# Altium schematic sheet INA226 Current Monitor.SchDoc: INA226 Current Monitor
size Letter; SheetNumber: 23
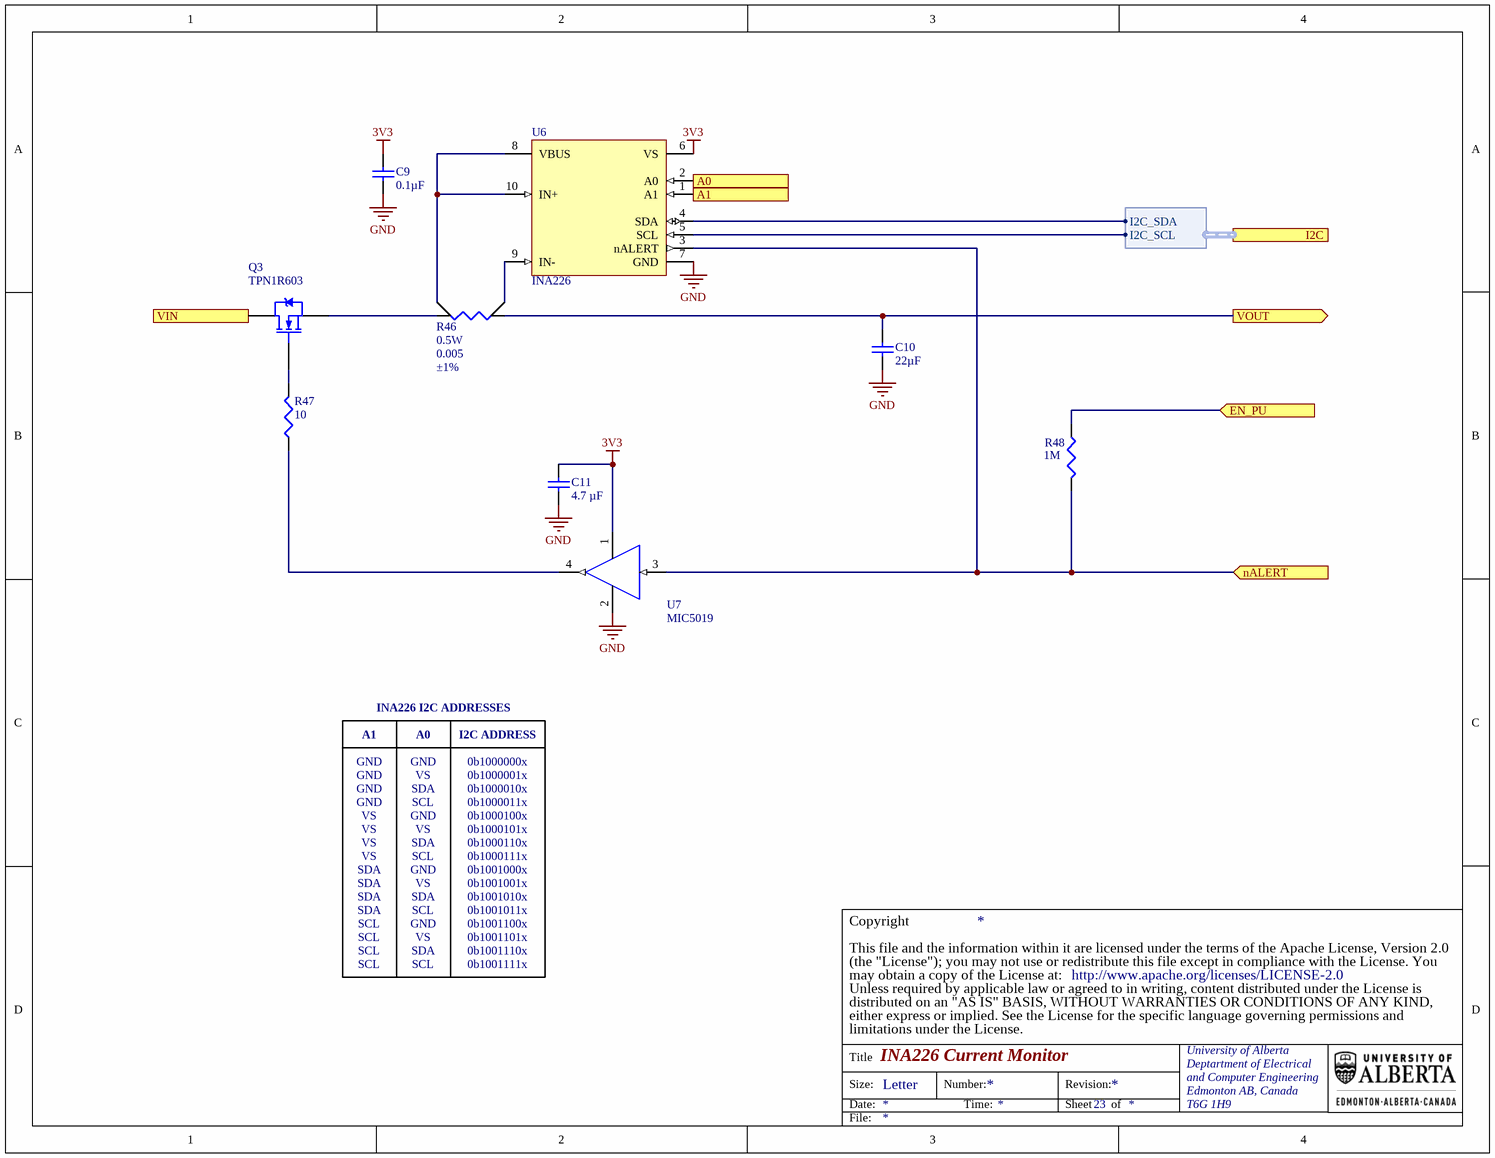
[diagram p0: INA226 Current Monitor.SchDoc]

## Parts
C9  value 0.1µF  [TDK-CGA2B]  (hidden comment: Cap)
C10  value 22µF  [TY-1206L]  (hidden comment: Cap)
C11  value 4.7 µF  [MUR-GRM188]  (hidden comment: Cap)
Q3  TPN1R603  [TOSH-S-3X1S]
R46  value 0.005  Power - Rated: 0.5W  Tolerance: ±1%  [BRN-CRF0805]  (hidden comment: Res Sense)
R47  value 10  [PANA-ERA2A]  (hidden comment: Res3)
R48  value 1M  [PANA-ERJ2R]  (hidden comment: Res3)
U6  INA226  [TI-DGS]
U7  MIC5019  [MCP-MIC5019]

## Ports
A0 (in), A1 (in), EN_PU (in), I2C (harness INA226_I2C), nALERT (in), VIN (in), VOUT (out)

## Harnesses
INA226_I2C: I2C_SCL, I2C_SDA

## Nets
3V3: C9.2 C11.2 U6.6(VS) U7.1(VDD)
GND: C9.1 C10.1 C11.1 U6.7(GND) U7.2(GND)
A0: U6.2(A0) ; port A0
A1: U6.1(A1) ; port A1
EN_PU: R48.2 ; port EN_PU
nALERT: R48.1 U6.3(nALERT) U7.3(IN) ; port nALERT
VIN: Q3.2(D) ; port VIN
VOUT: C10.2 R46.2(I2) ; port VOUT
NetQ3_1: Q3.1(G) R47.2
NetQ3_3: Q3.3(S) R46.1(I1)
NetR46_3: R46.3(S2) U6.9(IN-)
NetR46_4: R46.4(S1) U6.8(VBUS) U6.10(IN+)
NetR47_1: R47.1 U7.4(OUT)
NetU6_4: U6.4(SDA) ; port I2C.I2C_SDA
NetU6_5: U6.5(SCL) ; port I2C.I2C_SCL

## Notes on the sheet
- INA226 I2C ADDRESSES
- A1
- GND
- A0
- VS
- I2C ADDRESS
- 0b1000000x
- 0b1000001x
- SDA
- SCL
- 0b1000010x
- 0b1000011x
- 0b1000100x
- 0b1000101x
- 0b1000110x
- 0b1000111x
- 0b1001000x
- 0b1001001x
- 0b1001010x
- 0b1001011x
- 0b1001100x
- 0b1001101x
- 0b1001110x
- 0b1001111x
- (the "License"); you may not use or redistribute this file except in compliance with the License. You
- This file and the information within it are licensed under the terms of the Apache License, Version 2.0
- Copyright
- Unless required by applicable law or agreed to in writing, content distributed under the License is
- distributed on an "AS IS" BASIS, WITHOUT WARRANTIES OR CONDITIONS OF ANY KIND,
- either express or implied. See the License for the specific language governing permissions and
- limitations under the License.
- may obtain a copy of the License at:
- http://www.apache.org/licenses/LICENSE-2.0
- Title
- Size:
- Date:
- Letter
- Number:
- Time:
- Revision:
- Sheet
- of
- University of Alberta
- Deptartment of Electrical
- and Computer Engineering
- Edmonton AB, Canada
- T6G 1H9
- File:

## Library data of the parts
C9 = PC-TDK-02259: CAP CER 0.1UF 50V X7R 0402; Manufacturer Part Number: CGA2B3X7R1H104K050BB; Index: 2259; Designator: C?; Tolerance: ±10%; Published: 2016-03-16; LatestRevisionDate: 2016-03-16; LatestRevisionNote: ...; PackageReference: 0402 (1005 Metric); Publisher: AlbertaSat; PackageDescription: Radial Cap, Thru-Hole; 2 Leads; 0.3 in Pin Spacing; Part Number: PC-TDK-02259; Supplier Part Number 1: 445-6899-1-ND; Supplier 1: Digi-key; Supplier Link: http://www.digikey.ca/product-search/en?keywords=445-6899-1-ND; Voltage - Rated: 50V; Temperature Coefficient: X7R; Applications: Automotive; Operating Temperature: -55°C ~ 125°C
C10 = PC-TY-00721: CAP CER 22UF 16V X7R 1206; Manufacturer Part Number: EMK316BB7226ML-T; Index: 721; Designator: C?; Tolerance: ±20%; Published: 2016-03-13; LatestRevisionDate: 2016-03-13; LatestRevisionNote: ...; PackageReference: 1206 (3216 Metric); Publisher: AlbertaSat; PackageDescription: Chip Capacitor, 2-Leads, Body 3.20x1.60mm, IPC Low Density; Part Number: PC-TY-00721; Supplier Part Number 1: 587-4319-1-ND; Supplier 1: Digi-key; Supplier Link: http://www.digikey.ca/product-search/en?keywords=587-4319-1-ND; Voltage-Rated: 16V; Temperature Coefficient: X7R; Application: General Purpose; Operating Temperature: -55°C ~ 125°C
C11 = 10165: CAP CER 4.7UF 16V X7R 0603; Part Number: 10165; Manufacturer Part Number: GRM188Z71C475KE21D; Designator: C?; Tolerance: ±10%; Voltage - Rated: 25V; Published: 8-Jun-2000; LatestRevisionDate: 17-Jul-2002; LatestRevisionNote: Re-released for DXP Platform.; PackageReference: 0603 (1608 Metric); Publisher: Altium Limited; PackageDescription: Chip Capacitor, 2-Leads, Body 1.60x0.80mm, IPC Low Density; Supplier Part Number 1: 490-GRM188Z71C475KE21DCT-ND; Supplier 1: Digi-Key; Supplier Link: #https://www.digikey.ca/en/products/detail/murata-electronics/GRM188Z71C475KE21D/13401930#; Temperature Coefficient: X7R; Application: General Purpose; Operating Temperature: -55°C ~ 125°C; Supplier 2: Mouser; Supplier Part Number 2: 81-GRM188Z71C475KE1D
Q3 = PU-TOSH-00002: X35 PB-F POWER MOSFET TRANSISTOR; Index: 2; Designator: Q?; Rds On: 1.6mOhm @ 40A, 10V; Part Number: PU-TOSH-00002; Manufacturer Part Number: TPN1R603PL,L1Q; Supplier Part Number 1: TPN1R603PLL1QCT-ND; Supplier 1: Digi-key; Supplier Part Number 2: 757-TPN1R603PLL1Q; Supplier 2: Mouser; Publisher: AlbertaSat; Published: 2020-04-01; LatestRevisionDate: 2020-04-01; LatestRevisionNote: ...; PackageReference: 8-TSON Advance (3.3x3.3); PackageDescription: SON, 8-Leads, Body 3.10x3.10mm, Pitch 0.65mm, Thermal Pad 2.49x2.06mm, IPC Low Density; Supplier Link: #https://www.digikey.ca/product-detail/en/toshiba-semiconductor-and-storage/TPN1R603PL-L1Q/TPN1R603PLL1QCT-ND/6570930#; Operating Temperature: -55°C ~ 175°C (TJ)
R46 = PR-BRN-00023: RES 0.005 OHM 1% 1/2W 0805; Manufacturer Part Number: CRF0805-FZ-R005ELF; Index: 23; Designator: R?; Temperature Coefficient: ±50ppm/°C; Part Number: PR-BRN-00023; Supplier Part Number 1: CRF0805-FZ-R005ELFCT-ND; Supplier 1: Digi-key; Supplier Part Number 2: 652-CRF0805FZR005ELF; Supplier 2: Mouser; Publisher: AlbertaSat; Published: 2022-11-26; LatestRevisionDate: 2023-05-04; LatestRevisionNote: Added operating temperature; PackageReference: BRN-CRF0805; Supplier Link: #https://www.digikey.ca/en/products/detail/bourns-inc/CRF0805-FZ-R005ELF/6210977#; Operating Temperature: -55°C ~ 170°C
R47 = 13235: RES SMD 10 OHM 0.5% 1/16W 0402; Part Number: 13235; Manufacturer Part Number: ERA-2AKD100X; Designator: R?; Power: 0.063W, 1/16W; Temperature Coefficient: ±100ppm/°C; Published: 8-Jun-2000; LatestRevisionDate: 29-May-2009; LatestRevisionNote: IPC-7351 Footprint Added.; PackageReference: 0402 (1005 Metric); Publisher: Altium Limited; PackageDescription: Chip Resistor, 2-Leads, Body 1.00x0.50mm, IPC Low Density; Supplier Part Number 1: P10DDCT-ND; Supplier 1: Digi-Key; Supplier Link: http://www.digikey.ca/product-search/en?keywords=P10DDCT-ND; Tolerance: ±0.5%; Operating Temperature: -55°C ~ 155°C
R48 = 19704: RES SMD 1M OHM 1% 1/10W 0402; Part Number: 19704; Manufacturer Part Number: ERJ-2RKF1004X; Designator: R?; Power: 0.1W, 1/10W; Temperature Coefficient: ±100ppm/°C; Published: 8-Jun-2000; LatestRevisionDate: 29-May-2009; LatestRevisionNote: IPC-7351 Footprint Added.; PackageReference: 0402 (1005 Metric); Publisher: Altium Limited; PackageDescription: Chip Resistor, 2-Leads, Body 1.00x0.50mm, IPC Low Density; Supplier Part Number 1: P1.00MLCT-ND; Supplier 1: Digi-Key; Supplier Link: http://www.digikey.ca/product-search/en?keywords=P1.00MLCT-ND; Tolerance: ±1%; Operating Temperature: -55°C ~ 155°C
U6 = 19: IC MONITOR PWR/CURR BIDIR 10MSOP; Part Number: 19; Manufacturer Part Number: INA226AQDGSRQ1; Designator: U?; Supplier Part Number 2: 595-INA226AQDGSRQ1; Supplier 2: Mouser; Supplier Part Number 1: 296-42503-1-ND; Supplier 1: Digi-Key; Supplier Link: #https://www.digikey.com/product-detail/en/texas-instruments/INA226AQDGSRQ1/296-42503-1-ND/5416001#; PackageReference: TI-MSOP10; Operating Temperature: -40°C ~ 125°C
U7 = PU-MCP-00008: IC GATE DRVR HIGH-SIDE 4TQFN; Index: 8; Designator: U?; Part Number: PU-MCP-00008; Manufacturer Part Number: MIC5019YFT-TR; Supplier Part Number 1: 576-4152-1-ND; Supplier 1: Digi-key; Supplier Part Number 2: 998-MIC5019YFTTR; Supplier 2: Mouser; Publisher: AlbertaSat; Published: 2020-04-01; LatestRevisionDate: 2020-04-01; LatestRevisionNote: ...; PackageReference: 4-TQFN (1.2x1.2); Supplier Link: #https://www.digikey.ca/en/products/detail/microchip-technology/MIC5019YFT-TR/3681038#; Operating Temperature: -40°C ~ 125°C (TJ)